# EAGLE design Counter (EAGLE 9.5.2)
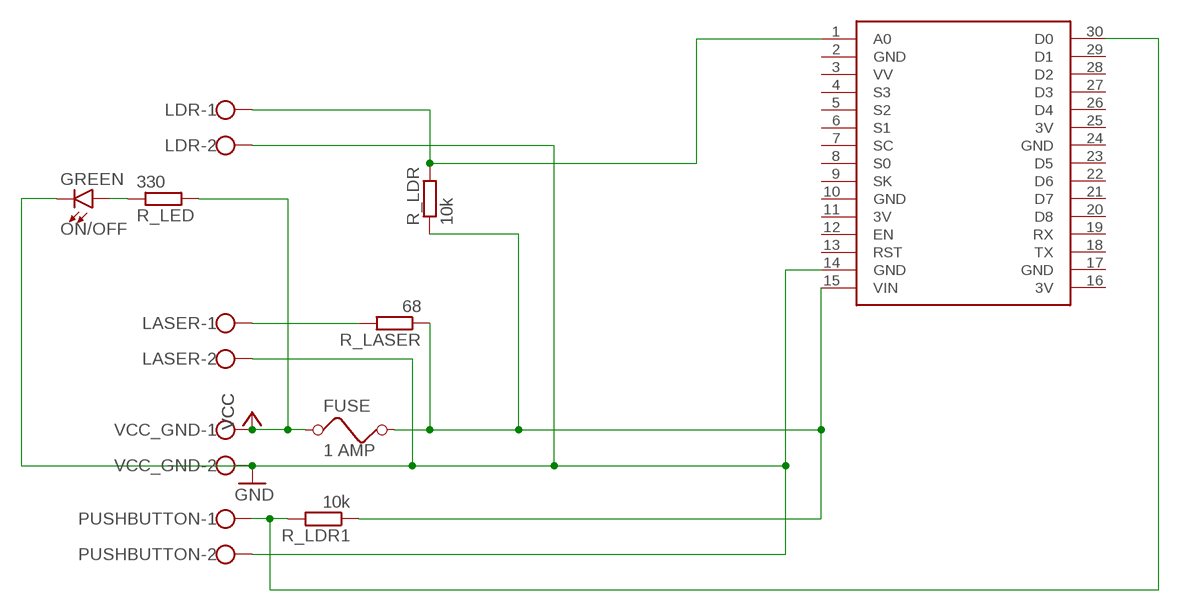
[diagram p0: schematic, sheet 1]

## Parts
FUSE  1 AMP  FUSE  [FUSE]
LASER  W237-102  [W237-102]
LDR  W237-102  [W237-102]
ON/OFF  GREEN  LED5MM  [LED_5MM]
PUSHBUTTON  W237-102  [W237-102]
R_LASER  68  R-EU_0207/10  [0207/10]
R_LDR  10k  R-EU_0207/10  [0207/10]
R_LDR1  10k  R-EU_0207/10  [0207/10]
R_LED  330  R-EU_0207/10  [0207/10]
U$1  NODEMCU  [NODEMCU]
VCC_GND  W237-102  [W237-102]

## Nets
GND [VCC]: LASER.2 LDR.2 ON/OFF.K(C) PUSHBUTTON.2 U$1.14(GND) VCC_GND.2
N$1: LDR.1 R_LDR.2 U$1.1(A0)
N$2: LASER.1 R_LASER.2
N$3: PUSHBUTTON.1 R_LDR1.2 U$1.30(D0)
N$5: ON/OFF.A R_LED.1
N$9 [VCC]: FUSE.2 R_LASER.1 R_LDR1.1 R_LDR.1 U$1.15(VIN)
VCC [VCC]: FUSE.1 R_LED.2 VCC_GND.1
Unconnected: U$1.3(VV) U$1.4(S3) U$1.5(S2) U$1.6(S1) U$1.7(SC) U$1.8(S0) U$1.9(SK) U$1.12(EN) U$1.13(RST) U$1.18(TX) U$1.19(RX) U$1.20(D8) U$1.21(D7) U$1.22(D6) U$1.23(D5) U$1.26(D4) U$1.27(D3) U$1.28(D2) U$1.29(D1)

## Power pins joined to a net without a drawn wire
3V: U$1.11(3V) U$1.16(3V) U$1.25(3V)
GND: U$1.2(GND) U$1.10(GND) U$1.17(GND) U$1.24(GND)

## Library data of the parts
FUSE = special:FUSE: FUSE 5 x 20 mm
LASER LDR PUSHBUTTON VCC_GND = con-wago-500:W237-102: WAGO SCREW CLAMP; MPN: 237-102; OC_FARNELL: unknown; OC_NEWARK: 70K9898
ON/OFF = SparkFun-LED:LED: LED (Generic) Standard schematic elements and footprints for 5mm, 3mm, 1206, and 0603 sized LEDs. Generic LEDs with no color specified.
R_LASER R_LDR R_LDR1 R_LED = rcl:R-EU_: RESISTOR, European symbol; SPICEPREFIX: R
U$1 = nodemcu:NODEMCU

## Net classes
0 default: width 1.016 mm, clearance 1.016 mm
1 VCC: width 1.27 mm, clearance 1.016 mm to class 0
2 GND: width 1.27 mm, clearance 1.016 mm to class 0

## Board
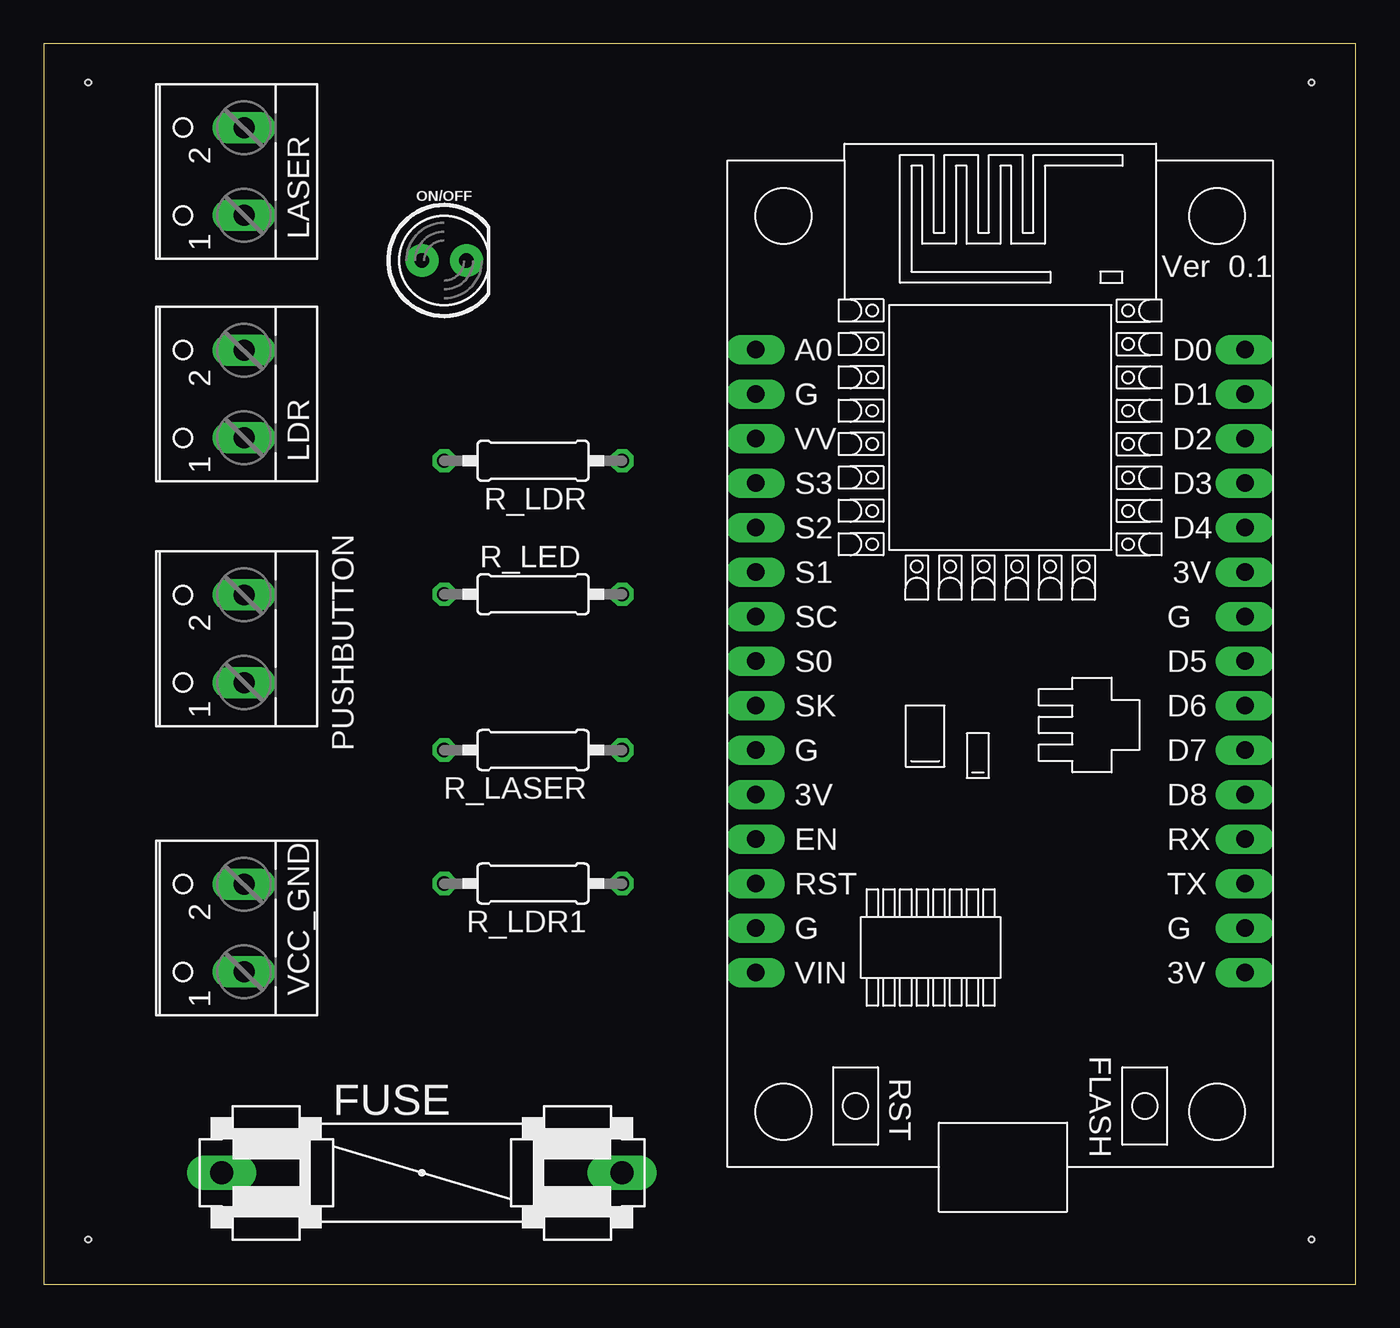
[diagram p1: board, top side]
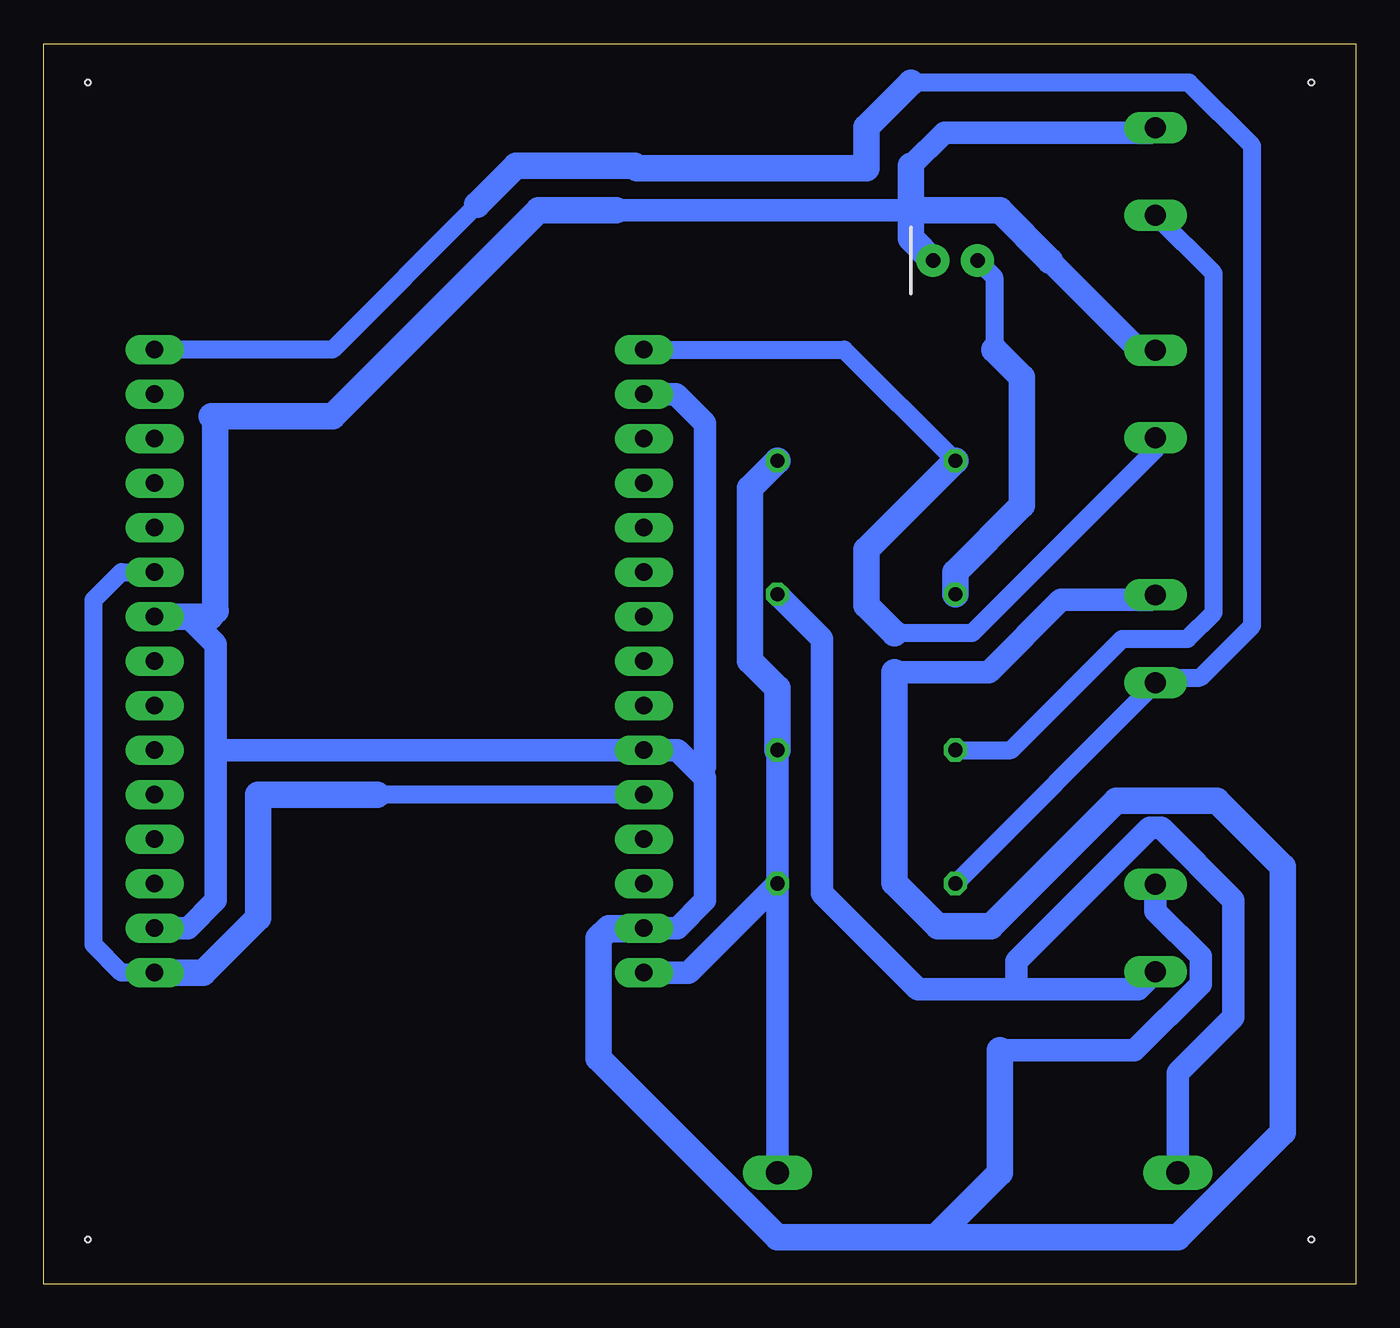
[diagram p2: board, bottom side, seen from below]

Size 74.91 x 70.79 mm. Coordinates in mm from the lower left corner, seen from the top.
Outline: 0,0 74.91,0 74.91,70.79 0,70.79 0,0
Copper layers (1*16): Top 0.035mm / dielectric 1.5mm / Bottom 0.035mm
Design rules "default": minimum track width 6mil, minimum drill 0.35mm, track to track 6mil, track to pad 6mil, pad to pad 6mil, via to via 6mil, smd to smd 6mil, copper to edge 40mil, drill to drill 6mil, minimum pad ring 10mil, minimum via ring 8mil, stop-mask expansion 4mil, vias tented up to drill 0mil, thermal gap 10mil
Holes 0.35 mm at 2.54,68.58 72.39,68.58 72.39,2.54 2.54,2.54

### Footprints (pad centres in the part's own frame; a part is rotated, then mirrored left to right if it is on the bottom)
FUSE = drill 1.321 long: 1 -11.43,0; 2 11.43,0
W237-102 = drill 1.194 long: 1 -2.5,-1.27; 2 2.5,-1.27
LED_5MM = drill 0.813 pad 1.88: A -1.27,0; K 1.27,0
0207/10 = drill 0.813 octagon: 1 -5.08,0; 2 5.08,0
NODEMCU = drill 1 pad 1.676 long: 1 -13.97,17.78; 2 -13.97,15.24; 3 -13.97,12.7; 4 -13.97,10.16; 5 -13.97,7.62; 6 -13.97,5.08; 7 -13.97,2.54; 8 -13.97,0; 9 -13.97,-2.54; 10 -13.97,-5.08; 11 -13.97,-7.62; 12 -13.97,-10.16; 13 -13.97,-12.7; 14 -13.97,-15.24; 15 -13.97,-17.78; 16 13.97,-17.78; 17 13.97,-15.24; 18 13.97,-12.7; 19 13.97,-10.16; 20 13.97,-7.62; 21 13.97,-5.08; 22 13.97,-2.54; 23 13.97,0; 24 13.97,2.54; 25 13.97,5.08; 26 13.97,7.62; 27 13.97,10.16; 28 13.97,12.7; 29 13.97,15.24; 30 13.97,17.78

### Placement (x,y rotation side)
FUSE  21.59,6.35 0 top
LASER  10.16,63.5 90 top
LDR  10.16,50.8 90 top
ON/OFF  22.86,58.42 0 top
PUSHBUTTON  10.16,36.83 90 top
R_LASER  27.94,30.48 180 top
R_LDR  27.94,46.99 180 top
R_LDR1  27.94,22.86 180 top
R_LED  27.94,39.37 0 top
U$1  54.61,35.56 0 top
VCC_GND  10.16,20.32 90 top

### Tracks (layer width: path | path; a pad name or v marks a point on that pad's centre or on a via)
3V
  Bottom 1.016: U$1.11 55.88,27.94 | U$1.25 70.48,40.64 72.07,39.05 72.07,19.37 70.48,17.78 U$1.16
  Bottom 1.524: 55.88,27.94 62.67,27.94 62.67,20.91 65.8,17.78 U$1.16
GND
  Bottom 1.27: U$1.17 66.67,20.32 65.09,21.91 65.09,30.48 | 65.09,30.48 65.09,36.51 66.67,38.1 U$1.24 | LASER.2 11.71,65.72 23.49,65.72 25.4,63.82 | U$1.14 38.73,20.32 37.15,21.91 37.15,28.89 37.47,29.21 | 37.47,29.21 38.73,30.48 U$1.10 65.09,30.48 | 37.47,29.21 37.15,29.53 37.15,49.13 38.82,50.8 U$1.2 | VCC_GND.2 11.43,21.27 8.85,18.69 8.85,17.12 12.64,13.33 20.32,13.33 | 26.35,34.92 20.95,34.92 16.83,39.05 11.71,39.05 PUSHBUTTON.2 | 25.4,61.28 42.23,61.28 | 65.09,38.42 65.41,38.1 | 17.46,58.42 12.34,53.3 LDR.2
  Bottom 1.524: ON/OFF.K 25.4,59.69 25.4,61.28 | 25.4,61.28 25.4,63.82 | 65.41,38.1 U$1.24 | 20.32,13.33 20.32,6.35 24,2.67 | 42.64,20.32 42.56,20.24 40.64,20.24 | 26.35,34.92 26.35,22.9 23.87,20.42 20.82,20.42 13.66,27.58 7.93,27.58 4.17,23.82 4.17,8.66 10.16,2.67 24,2.67 | U$1.14 42.64,20.32 | 42.23,61.28 46.67,61.28 58.42,49.53 65.31,49.53 65.13,49.34 65.13,38.46 65.09,38.42 | 17.46,58.42 20.32,61.28 25.4,61.28 | 24,2.67 33.02,2.67 43.23,12.88 43.23,19.73 42.64,20.32
N$1
  Bottom 1.016: 26.35,37.15 21.91,37.15 11.43,47.62 LDR.1 | U$1.1 29.21,53.34 R_LDR.2
  Bottom 1.524: 26.35,37.15 27.94,38.73 27.94,41.91 R_LDR.2
N$2
  Bottom 1.016: R_LASER.2 19.69,30.48 13.33,36.83 9.61,36.83 8.11,38.33 8.11,57.69 LASER.1
N$3
  Bottom 1.016: R_LDR1.2 11.43,34.29 PUSHBUTTON.1 11.15,34.61 8.87,34.61 5.91,37.58 5.91,64.96 9.52,68.58 25.4,68.58 | U$1.30 58.42,53.34 50.16,61.59
  Bottom 1.524: 25.4,68.58 27.94,66.04 27.94,63.69 41.05,63.69 41.17,63.82 47.94,63.82 50.16,61.59
N$5
  Bottom 1.016: 20.64,53.34 20.64,57.47 ON/OFF.A
  Bottom 1.524: R_LED.1 22.86,40.64 19.05,44.45 19.05,51.75 20.64,53.34
N$9
  Bottom 1.27: R_LASER.1 R_LDR1.1 | U$1.15 38.1,17.78 R_LDR1.1 | R_LDR1.1 FUSE.2
  Bottom 1.524: R_LASER.1 33.02,34 34.59,35.58 34.59,45.41 R_LDR.1
VCC
  Bottom 1.27: 19.37,16.83 12.42,16.83 VCC_GND.1 | FUSE.1 10.16,12.07 6.98,15.24 6.98,21.91 11.11,26.04 11.75,26.04 19.37,18.42 19.37,16.83 | R_LED.2 30.48,36.83 30.48,22.3 25.01,16.83 19.37,16.83